# Altium schematic sheet 电流环.SchDoc
size A4
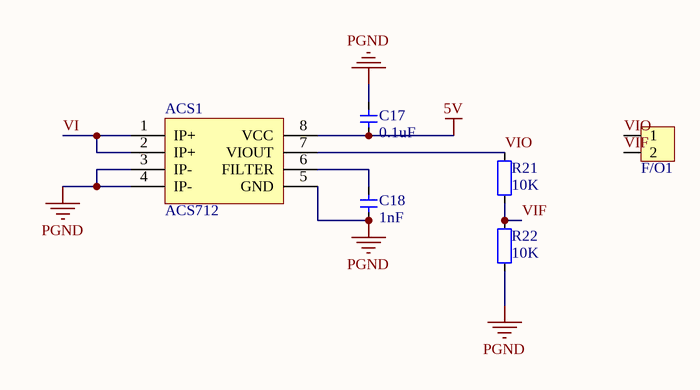
[diagram p0: 电流环.SchDoc]

## Parts
ACS1  ACS712  [SOP8ACS712]
C17  value 0.1uF  [CAP_0603]  (hidden comment: Cap_0603)
C18  value 1nF  [CAP_0603]  (hidden comment: Cap_0603)
F/O1  HDR1x2_2.54  [HDR1X2_2.54_180]  (value not drawn)
R21  value 10K  [RES_0603]  (hidden comment: Res_0603)
R22  value 10K  [RES_0603]  (hidden comment: Res_0603)

## Nets
5V: ACS1.8(VCC) C17.1
PGND: ACS1.3(IP-) ACS1.4(IP-) ACS1.5(GND) C17.2 C18.1 R22.2
VI: ACS1.1(IP+) ACS1.2(IP+)
VIF: F/O1.2 R21.2 R22.1
VIO: ACS1.7(VIOUT) F/O1.1 R21.1
NetACS1_6: ACS1.6(FILTER) C18.2

## Library data of the parts
ACS1 = ACS712: Sensor Current
C17 C18 = Cap_0603: Capacitor
F/O1 = HDR1x2_2.54: Header
R21 R22 = Res_0603: Resistor